# EAGLE design Score controller (EAGLE 9.1.0)
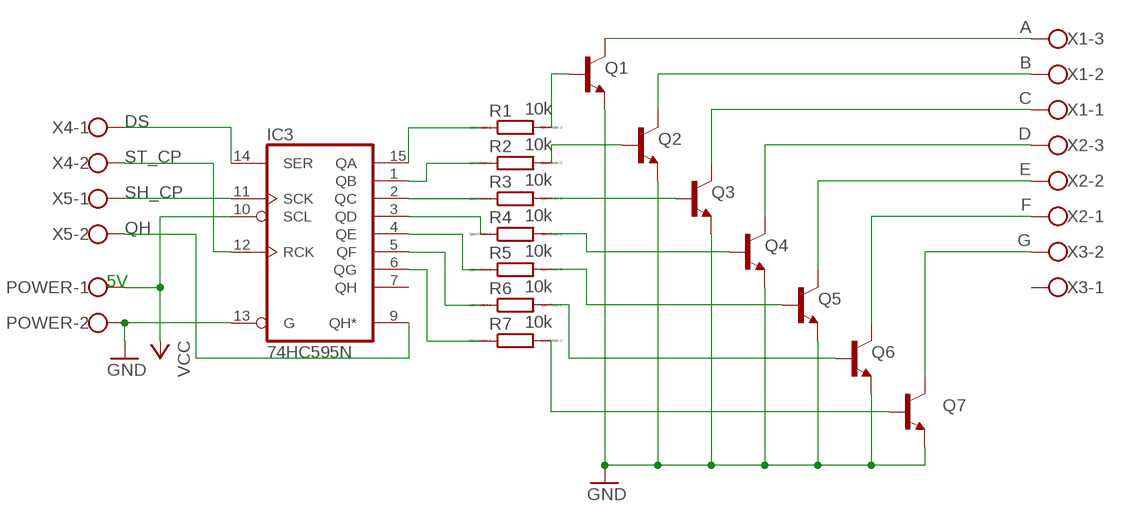
[diagram p0: schematic, sheet 1]

## Parts
IC3  74HC595N  [DIL16]
POWER  W237-102  [W237-102]
Q1  BC338-40  [TO92-EBC]
Q2  BC338-40  [TO92-EBC]
Q3  BC338-40  [TO92-EBC]
Q4  BC338-40  [TO92-EBC]
Q5  BC338-40  [TO92-EBC]
Q6  BC338-40  [TO92-EBC]
Q7  BC338-40  [TO92-EBC]
R1  10k  R0204/7  [0204/7]
R2  10k  R0204/7  [0204/7]
R3  10k  R0204/7  [0204/7]
R4  10k  R0204/7  [0204/7]
R5  10k  R0204/7  [0204/7]
R6  10k  R0204/7  [0204/7]
R7  10k  R0204/7  [0204/7]
X1  W237-103  [W237-103]
X2  W237-103  [W237-103]
X3  W237-102  [W237-102]
X4  W237-102  [W237-102]
X5  W237-102  [W237-102]

## Nets
A: Q1.C X1.3
B: Q2.C X1.2
C: Q3.C X1.1
D: Q4.C X2.3
DS: IC3.14(SER) X4.1
E: Q5.C X2.2
F: Q6.C X2.1
G: Q7.C X3.2
GND: IC3.13(G) POWER.2 Q1.E Q2.E Q3.E Q4.E Q5.E Q6.E Q7.E
N$1: IC3.1(QB) R2.1
N$2: Q1.B R1.2
N$3: IC3.2(QC) R3.1
N$4: IC3.15(QA) R1.1
N$5: Q2.B R2.2
N$6: IC3.3(QD) R4.1
N$7: IC3.4(QE) R5.1
N$8: IC3.5(QF) R6.1
N$9: IC3.6(QG) R7.1
N$10: Q3.B R3.2
N$11: Q4.B R4.2
N$12: Q5.B R5.2
N$13: Q6.B R6.2
N$14: Q7.B R7.2
QH: IC3.9(QH*) X5.2
SH_CP: IC3.11(SCK) X5.1
ST_CP: IC3.12(RCK) X4.2
VCC: IC3.10(SCL) POWER.1
Unconnected: IC3.7(QH) X3.1

## Notes on the sheet
- 5V

## Power pins joined to a net without a drawn wire
GND: IC3.8(GND)
VCC: IC3.16(VCC)

## Library data of the parts
IC3 = 74xx-eu:74*595: 8-bit SHIFT REGISTER, output latch
POWER X3-X5 = con-wago-500:W237-102: WAGO SCREW CLAMP; MPN: 237-102; OC_FARNELL: unknown; OC_NEWARK: 70K9898
Q1-Q7 = transistor-npn:BC338*: NPN Transistor
R1-R7 = eagle-ltspice:R: RESISTOR, European symbol; SPICEMODEL: NONE; SPICEPREFIX: R
X1 X2 = con-wago-500:W237-103: WAGO SCREW CLAMP; MPN: 237-103; OC_FARNELL: unknown; OC_NEWARK: 18M7116

## Board
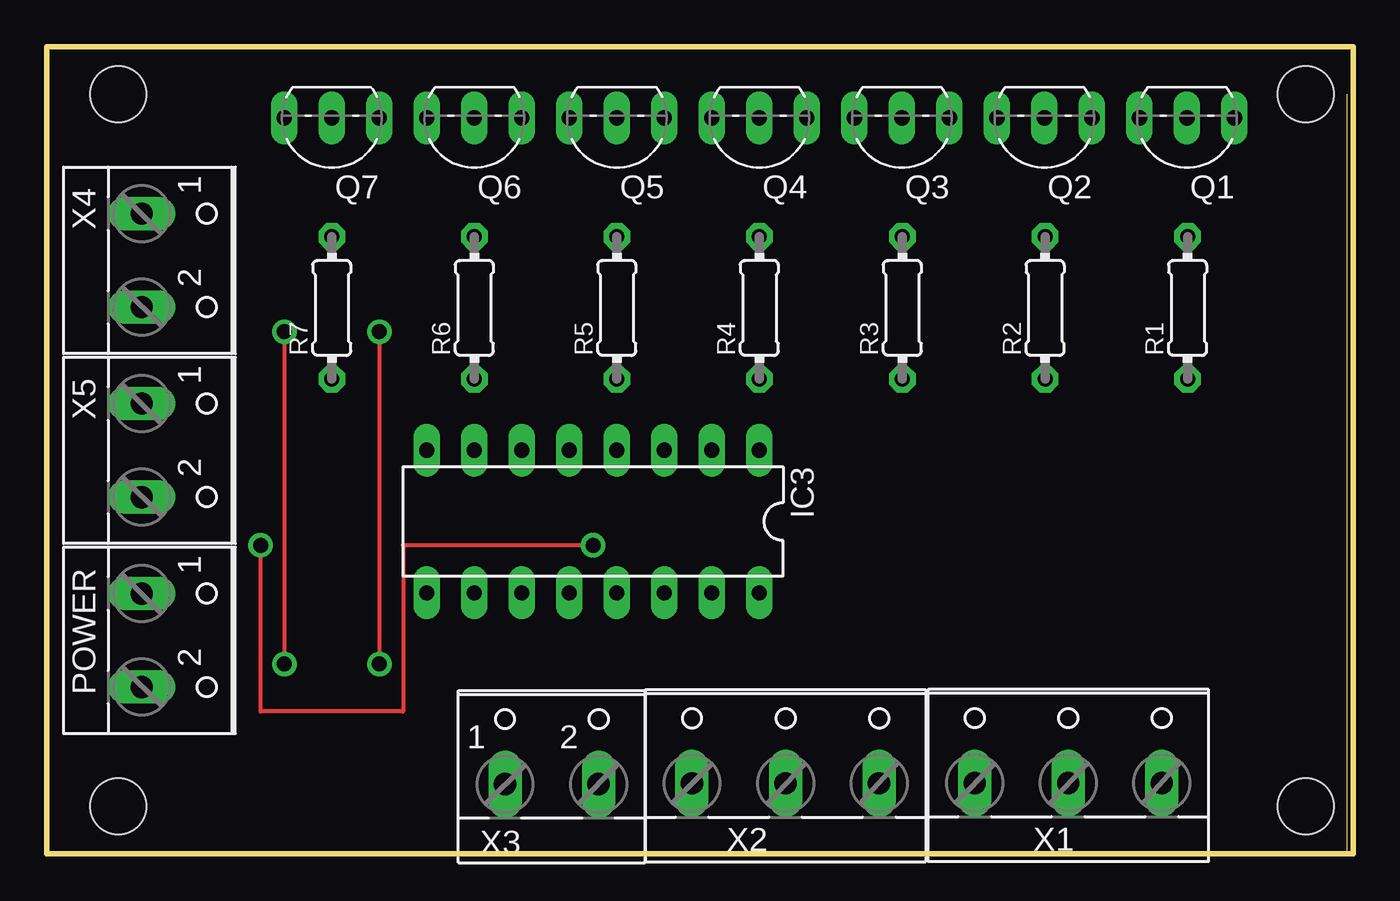
[diagram p1: board, top side]
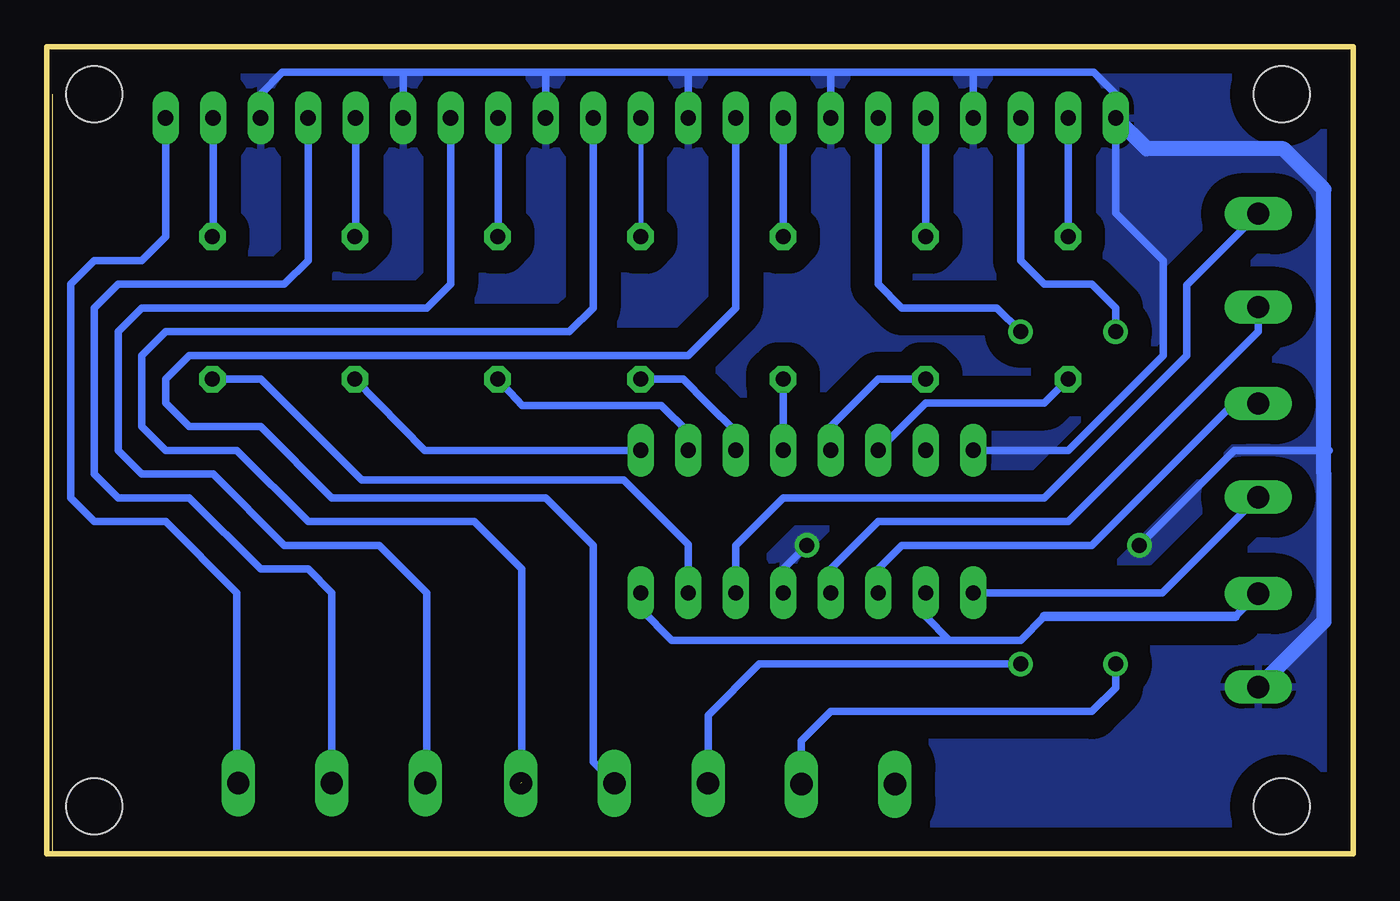
[diagram p2: board, bottom side, seen from below]

Size 69.85 x 43.18 mm. Coordinates in mm from the lower left corner, seen from the top.
Outline: 0,0 69.52,0 69.52,40.63
Outline: 0,40.63 0,0
Outline: 0,0 69.85,0 69.85,43.18 0,43.18 0,0
Copper layers (1*16): Top 0.035mm / dielectric 1.5mm / Bottom 0.035mm
Design rules "SparkFun": minimum track width 8mil, minimum drill 20mil, track to track 8mil, track to pad 8mil, pad to pad 8mil, via to via 8mil, smd to smd 8mil, copper to edge 8mil, drill to drill 8mil, minimum pad ring 12mil, minimum via ring 10mil, stop-mask expansion 4mil, vias tented up to drill 20mil, thermal gap 10mil
Holes 3 mm at 3.81,2.54 3.81,40.64 67.31,40.64 67.31,2.54

### Footprints (pad centres in the part's own frame; a part is rotated, then mirrored left to right if it is on the bottom)
DIL16 = drill 0.813 long: 1 -8.89,-3.81; 2 -6.35,-3.81; 3 -3.81,-3.81; 4 -1.27,-3.81; 5 1.27,-3.81; 6 3.81,-3.81; 7 6.35,-3.81; 8 8.89,-3.81; 9 8.89,3.81; 10 6.35,3.81; 11 3.81,3.81; 12 1.27,3.81; 13 -1.27,3.81; 14 -3.81,3.81; 15 -6.35,3.81; 16 -8.89,3.81
W237-102 = drill 1.194 long: 1 -2.5,-1.27; 2 2.5,-1.27
TO92-EBC = drill 0.813 long: B 0,-1.27; C -2.54,-1.27; E 2.54,-1.27
0204/7 = drill 0.813 octagon: 1 -3.81,0; 2 3.81,0
W237-103 = drill 1.194 long: 1 -5,-1.29; 2 0,-1.29; 3 5,-1.29

### Placement (x,y rotation side)
IC3  29.21,17.78 180 top
POWER  6.35,11.43 270 top
Q1  60.96,38.1 180 top
Q2  53.34,38.1 180 top
Q3  45.72,38.1 180 top
Q4  38.1,38.1 180 top
Q5  30.48,38.1 180 top
Q6  22.86,38.1 180 top
Q7  15.24,38.1 180 top
R1  61,29.21 90 top
R2  53.38,29.21 90 top
R3  45.74,29.21 90 top
R4  38.1,29.21 90 top
R5  30.48,29.21 90 top
R6  22.86,29.21 90 top
R7  15.24,29.21 90 top
X1  54.61,5.08 0 top
X2  39.5,5.06 0 top
X3  27,5 0 top
X4  6.35,31.75 270 top
X5  6.35,21.59 270 top

### Tracks (layer width: path | path; a pad name or v marks a point on that pad's centre or on a via)
A
  Bottom 0.406: Q1.C 63.5,33.02 64.77,31.75 67.31,31.75 68.58,30.48 68.58,19.05 67.31,17.78 63.5,17.78 59.69,13.97 59.69,3.87 X1.3
B
  Bottom 0.406: Q2.C 55.88,31.75 57.15,30.48 66.04,30.48 67.31,29.21 67.31,20.32 66.04,19.05 62.23,19.05 58.42,15.24 55.88,15.24 54.61,13.97 X1.2
C
  Bottom 0.406: Q3.C 48.26,30.48 49.53,29.21 64.77,29.21 66.04,27.94 66.04,21.59 64.77,20.32 60.96,20.32 57.15,16.51 52.07,16.51 49.53,13.97 49.53,3.87 X1.1
D  (1 unrouted)
  Bottom 0.406: Q4.C 40.64,29.21 41.91,27.94 63.5,27.94 64.77,26.67 64.77,22.86 63.5,21.59 59.69,21.59 55.88,17.78 46.99,17.78 44.45,15.24 44.45,3.81
DS
  Bottom 0.406: X4.1 8.89,30.44 8.89,26.67 16.51,19.05 30.48,19.05 33.02,16.51 IC3.14
E
  Bottom 0.406: Q5.C 33.02,29.21 35.56,26.67 62.23,26.67 63.5,25.4 63.5,24.13 62.23,22.86 58.42,22.86 54.61,19.05 43.18,19.05 40.64,16.51 40.64,4.92 X2.2
F  (via drill 0.8)
  Top 0.203: v17.78,27.94 v17.78,10.16
  Bottom 0.406: v17.78,27.94 19.05,29.21 24.13,29.21 25.4,30.48 Q6.C | v17.78,10.16 31.75,10.16 34.5,7.41 X2.1
G  (via drill 0.8)
  Top 0.203: v12.7,27.94 v12.7,10.16
  Bottom 0.406: v12.7,27.94 12.7,29.21 13.97,30.48 16.51,30.48 17.78,31.75 Q7.C | v12.7,10.16 12.7,8.89 13.97,7.62 27.94,7.62 29.21,6.35 | 29.21,6.35 29.46,6.1 | 29.21,6.35 29.5,6.06 X3.2
GND  (via drill 0.8)
  Top 0.203: v29.21,16.51 19.05,16.51 19.05,7.62 11.43,7.62 v11.43,16.51
  Bottom 0.406: Q1.E 58.42,40.64 57.25,41.81 50.8,41.81 | 20.32,41.81 13.87,41.81 12.7,40.64 Q7.E 12.7,34.29 10.16,31.75 10.16,26.67 15.24,21.59 IC3.8 | 20.32,41.81 27.94,41.81 | 27.94,41.81 35.56,41.81 | 35.56,41.81 43.18,41.81 | 43.18,41.81 50.8,41.81 | 50.8,41.81 50.8,39.27 Q2.E | 43.18,41.81 43.18,39.27 Q3.E | 35.56,41.81 35.56,39.27 Q4.E | 27.94,41.81 27.94,39.27 Q5.E | 20.32,41.81 20.32,39.27 Q6.E | v11.43,16.51 6.35,21.59 1.27,21.59 | v29.21,16.51 30.48,15.24 IC3.13
  Bottom 0.813: POWER.2 1.57,12.44 1.57,20.32 1.57,35.56 3.73,37.72 11.05,37.72 Q7.E
  pour Bottom (isolate 1.27): -1.27,-1.27 71.12,-1.27 71.12,44.45 -1.27,44.45
N$1
  Bottom 0.406: IC3.1 49.64,21.59 R2.1
N$2
  Bottom 0.254: R1.2 60.96,32.85
  Bottom 0.406: Q1.B 60.96,32.85
N$3
  Bottom 0.406: R3.1 44.42,24 37,24 35.56,22.56 IC3.2
N$4
  Bottom 0.406: IC3.15 35.56,16.56 39,20 53.02,20 58.42,25.4 60.79,25.4 R1.1
N$5
  Bottom 0.406: Q2.B 53.34,35.56 53.34,33.06 R2.2
N$6
  Bottom 0.406: R4.1 35.83,25.4 34.56,24.13 33.02,22.59 IC3.3
N$7
  Bottom 0.406: IC3.4 R5.1
N$8
  Bottom 0.406: IC3.5 27.94,22.86 25.4,25.4 R6.1
N$9
  Bottom 0.406: IC3.6 22.86,24.13 16.51,24.13 R7.1
N$10
  Bottom 0.254: R3.2 45.72,32.97
  Bottom 0.406: Q3.B 45.72,32.97
N$11
  Bottom 0.254: Q4.B R4.2
N$12
  Bottom 0.406: Q5.B R5.2
N$13
  Bottom 0.406: Q6.B R6.2
N$14
  Bottom 0.406: Q7.B R7.2
QH
  Bottom 0.406: X5.2 10.2,13.97 IC3.9
SH_CP
  Bottom 0.406: IC3.11 25.4,15.24 24.13,16.51 13.97,16.51 6.39,24.09 X5.1
ST_CP
  Bottom 0.406: IC3.12 27.94,15.24 25.4,17.78 15.24,17.78 5.08,27.94 X4.2
VCC
  Bottom 0.406: IC3.10 22.86,12.7 21.59,11.43 | 21.59,11.43 17.78,11.43 16.51,12.7 | 6.31,12.7 POWER.1 | 21.59,11.43 34,11.43 34.29,11.43 36.43,11.43 38.1,13.1 IC3.16
  Bottom 0.508: 16.51,12.7 6.31,12.7